# Altium schematic sheet PWM_CAPTURE_VREF.SchDoc
size A4; SheetNumber: 8; SheetTotal: 29
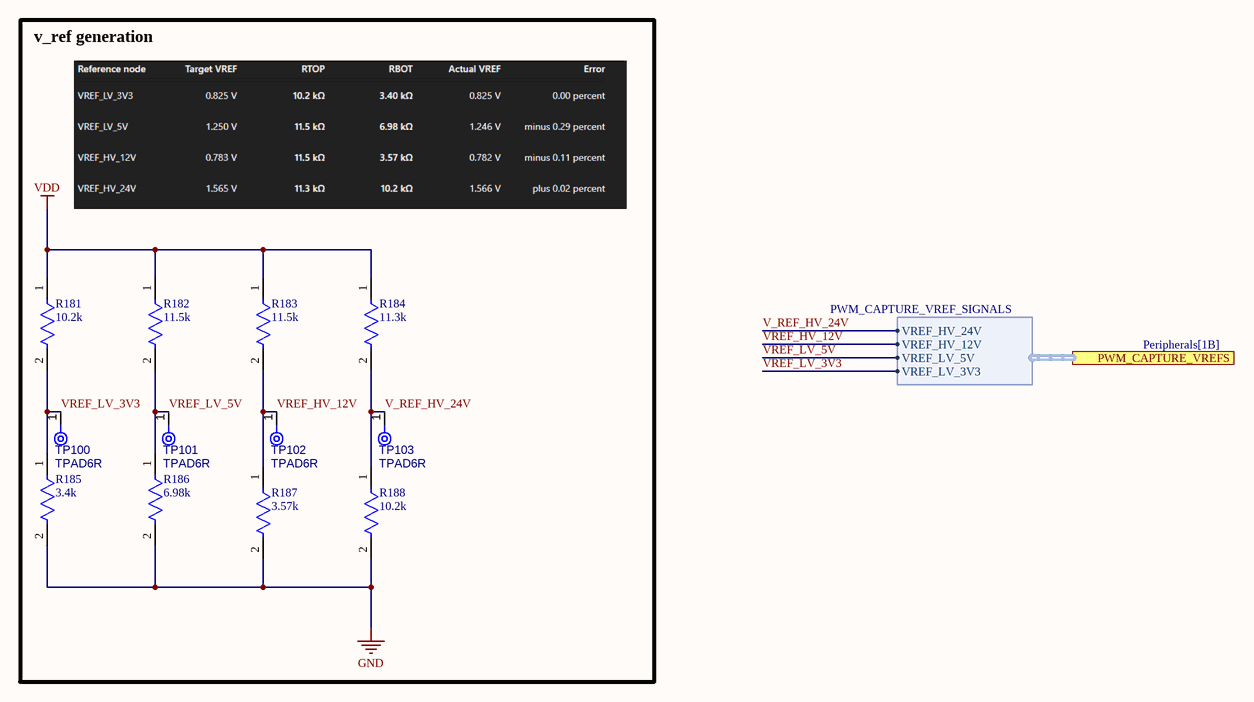
[diagram p0: PWM_CAPTURE_VREF.SchDoc]

## Parts
R181  value 10.2k  [FP-RT0805-MFG]  (hidden comment: RT0805BRD0710K2L)
R182  value 11.5k  [FP-RT0603-IPC_C]  (hidden comment: RT0603BRD0711K5L)
R183  value 11.5k  [FP-RT0603-IPC_C]  (hidden comment: RT0603BRD0711K5L)
R184  value 11.3k  [FP-RT0603-IPC_C]  (hidden comment: RT0603BRD0711K3L)
R185  value 3.4k  [FP-RT0603-IPC_C]  (hidden comment: RT0603BRD073K4L)
R186  value 6.98k  [FP-RT0603-IPC_C]  (hidden comment: RT0603BRD076K98L)
R187  value 3.57k  [FP-RT0603-IPC_C]  (hidden comment: RT0603BRD073K57L)
R188  value 10.2k  [FP-RT0805-MFG]  (hidden comment: RT0805BRD0710K2L)
TP100  TPAD6R  [TP06R]  (no BOM)
TP101  TPAD6R  [TP06R]  (no BOM)
TP102  TPAD6R  [TP06R]  (no BOM)
TP103  TPAD6R  [TP06R]  (no BOM)

## Blocks framed on the sheet
v_ref generation: R181-R188 TP100-TP103

## Ports
PWM_CAPTURE_VREFS (harness PWM_CAPTURE_VREF_SIGNALS, see Peripherals[1B])

## Harnesses
PWM_CAPTURE_VREF_SIGNALS: VREF_LV_3V3, VREF_LV_5V, VREF_HV_12V, VREF_HV_24V

## Nets
GND: R185.2 R186.2 R187.2 R188.2
VDD: R181.1 R182.1 R183.1 R184.1
V_REF_HV_24V: R184.2 R188.1 TP103.1(TP) ; port PWM_CAPTURE_VREFS.VREF_HV_24V
VREF_HV_12V: R183.2 R187.1 TP102.1(TP) ; port PWM_CAPTURE_VREFS.VREF_HV_12V
VREF_LV_3V3: R181.2 R185.1 TP100.1(TP) ; port PWM_CAPTURE_VREFS.VREF_LV_3V3
VREF_LV_5V: R182.2 R186.1 TP101.1(TP) ; port PWM_CAPTURE_VREFS.VREF_LV_5V

## Library data of the parts
R181 R188 = CMP-009-00340-1: 125mW Thin Film Resistor ±25ppm/℃ ±0.1% 10.2kΩ 0805 Chip Resistor - Surface Mount ROHS; Manufacturer Package Identifier: 0805 (2012 metric); Voltage Rating: 150V; Temperature Coefficient: 25ppm/°C; Composition: Thin Film; Max Operating Temperature: 155°C; Case/Package: 0805; Min Operating Temperature: -55°C; Harmonized Tariff Schedule (HTS) Code: 8533.21.00.30; Termination: SMD/SMT; Height: 500µm; Width: 1.25mm; Schedule B: 8533210045, 8533210045; Number of Terminations: 2; REACH SVHC: Yes; Lifecycle Status: Production; RoHS: Compliant; Max Power Dissipation: 125mW; Mounting Technology: Surface Mount; Length: 2mm; Number of Terminals: 2; Power Rating: 125mW; Voltage Rating (DC): 150V; Country of Origin: Mainland China, Taiwan; Introduction Date: 2008-06-09; China RoHS: Non-Compliant; Tolerance: 0.1%; Working Voltage: 150V; Lead Free: Lead Free; Case Code (Imperial): 0805; Export Control Classification Number (ECCN) Code: EAR99; Weight: 5.499807mg
R182 R183 = CMP-009-00263-1: 100mW Thin Film Resistor 75V ±25ppm/℃ ±0.1% 11.5kΩ 0603 Chip Resistor - Surface Mount ROHS; Temperature Coefficient: 25ppm/°C; Harmonized Tariff Schedule (HTS) Code: 8533.21.00.30; Length: 1.6mm; Working Voltage: 75V; Termination: SMD/SMT; REACH SVHC: Yes; Lead Free: Lead Free; Depth: 800µm; Tolerance: 0.1%; Military Standard: Not; Lifecycle Status: Production; Number of Terminals: 2; Power Rating: 100mW; Introduction Date: 2008-06-09; Schedule B: 8533210045, 8533210045; China RoHS: Non-Compliant; Max Power Dissipation: 100mW; Number of Terminations: 2; Height: 450µm; Case/Package: 0603; Country of Origin: Mainland China, Taiwan; Weight: 2.012816mg; Case Code (Imperial): 0603; Voltage Rating: 75V; RoHS: Compliant; Mounting Technology: Surface Mount; Voltage Rating (DC): 75V; Width: 800µm; Min Operating Temperature: -55°C; Composition: Thin Film; Export Control Classification Number (ECCN) Code: EAR99; Features: Moisture Resistant; Max Operating Temperature: 155°C
R184 = CMP-009-00337-1: 100mW Thin Film Resistor 75V ±25ppm/℃ ±0.1% 11.3kΩ 0603 Chip Resistor - Surface Mount ROHS; Temperature Coefficient: 25ppm/°C; Tolerance: 0.1%; Width: 800µm; Mounting Technology: Surface Mount; Length: 1.6mm; REACH SVHC: Yes; Voltage Rating: 75V; Power Rating: 100mW; Min Operating Temperature: -55°C; RoHS: Compliant; Case/Package: 0603; Termination: SMD/SMT; China RoHS: Non-Compliant; Working Voltage: 75V; Max Operating Temperature: 155°C; Composition: Thin Film; Height: 450µm; Max Power Dissipation: 100mW; Number of Terminations: 2; Lead Free: Lead Free; Number of Terminals: 2; Military Standard: Not; Voltage Rating (DC): 75V; Case Code (Imperial): 0603; Depth: 800µm; Lifecycle Status: Production
R185 = CMP-009-00277-1: Res Thin Film 0603 3.4K Ohm 0.1% 0.1W(1/10W) ±25ppm/C Pad SMD T/R; Voltage Rating (DC): 50V; Voltage Rating: 75V; Power Rating: 100mW; Temperature Coefficient: 25ppm/°C; Features: Moisture Resistant; Contact Plating: Tin; Number of Terminations: 2; Introduction Date: 2008-06-09; Tolerance: 0.1%; Number of Terminals: 2; China RoHS: Non-Compliant; Mounting Technology: Surface Mount; Lead Free: Lead Free; Case Code (Imperial): 0603; Lifecycle Status: Production; Height: 450µm; Termination: SMD/SMT; REACH SVHC: Yes; Width: 800µm; Weight: 2.012816mg; Harmonized Tariff Schedule (HTS) Code: 8533.21.00.30; Composition: Thin Film; Max Power Dissipation: 100mW; RoHS: Compliant; Depth: 800µm; Case/Package: 0603; Min Operating Temperature: -55°C; Schedule B: 8533210045, 8533210045; Military Standard: Not; Length: 1.6mm; Max Operating Temperature: 155°C; Radiation Hardening: No; Country of Origin: Mainland China, Taiwan; Working Voltage: 75V; Export Control Classification Number (ECCN) Code: EAR99
R186 = CMP-009-00270-1: 100mW Thin Film Resistor ±25ppm/℃ ±0.1% 6.98kΩ 0603 Chip Resistor - Surface Mount ROHS; Temperature Coefficient: 25ppm/°C; Working Voltage: 75V; Voltage Rating (DC): 50V; China RoHS: Non-Compliant; REACH SVHC: Yes; Termination: SMD/SMT; Lifecycle Status: Production; Number of Terminations: 2; Width: 800µm; Power Rating: 100mW; Length: 1.6mm; Max Power Dissipation: 100mW; RoHS: Compliant; Height: 450µm; Tolerance: 0.1%; Voltage Rating: 75V; Schedule B: 8533210045, 8533210045; Min Operating Temperature: -55°C; Lead Free: Lead Free; Case/Package: 0603; Mounting Technology: Surface Mount; Features: Moisture Resistant; Composition: Thin Film; Case Code (Imperial): 0603; Number of Terminals: 2; Max Operating Temperature: 155°C
R187 = CMP-009-00278-1: 100mW Thin Film Resistor ±25ppm/℃ ±0.1% 3.57kΩ 0603 Chip Resistor - Surface Mount ROHS; Working Voltage: 75V; Voltage Rating (DC): 50V; Temperature Coefficient: 25ppm/°C; Tolerance: 0.1%; Termination: SMD/SMT; Composition: Thin Film; Min Operating Temperature: -55°C; Width: 800µm; Height: 450µm; Harmonized Tariff Schedule (HTS) Code: 8533.21.00.30; Case/Package: 0603; Schedule B: 8533210045, 8533210045; Max Operating Temperature: 155°C; China RoHS: Non-Compliant; Country of Origin: Mainland China, Taiwan; Number of Terminations: 2; Export Control Classification Number (ECCN) Code: EAR99; Length: 1.6mm; Power Rating: 100mW; Case Code (Imperial): 0603; Depth: 800µm; REACH SVHC: Yes; Military Standard: Not; Voltage Rating: 75V; Weight: 2.012816mg; Mounting Technology: Surface Mount; Lead Free: Lead Free; Lifecycle Status: Production; Introduction Date: 2008-06-09; Max Power Dissipation: 100mW; RoHS: Compliant; Features: Moisture Resistant; Number of Terminals: 2
TP100-TP103 = CMP-00028-00002-2: 0.6mm round; Pins: 1